# Altium project Autoinformer.PrjPcb (part 1 of 2)
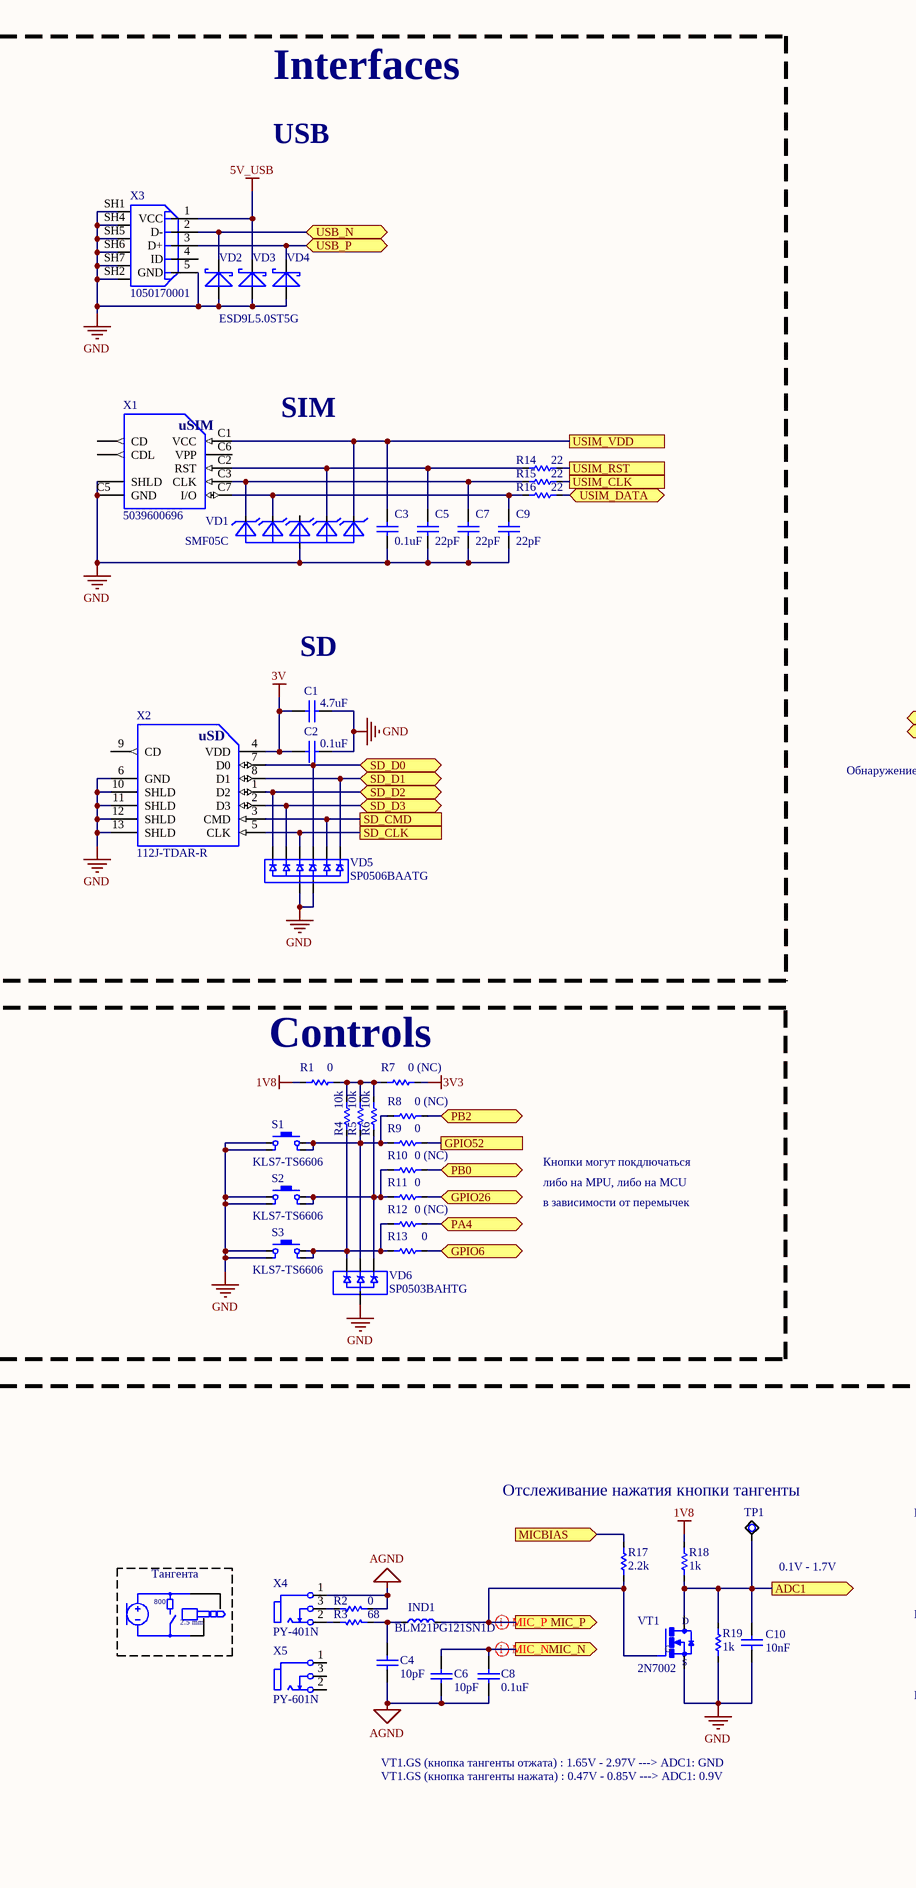
[diagram p0: Sh1_MPU.SchDoc, left]
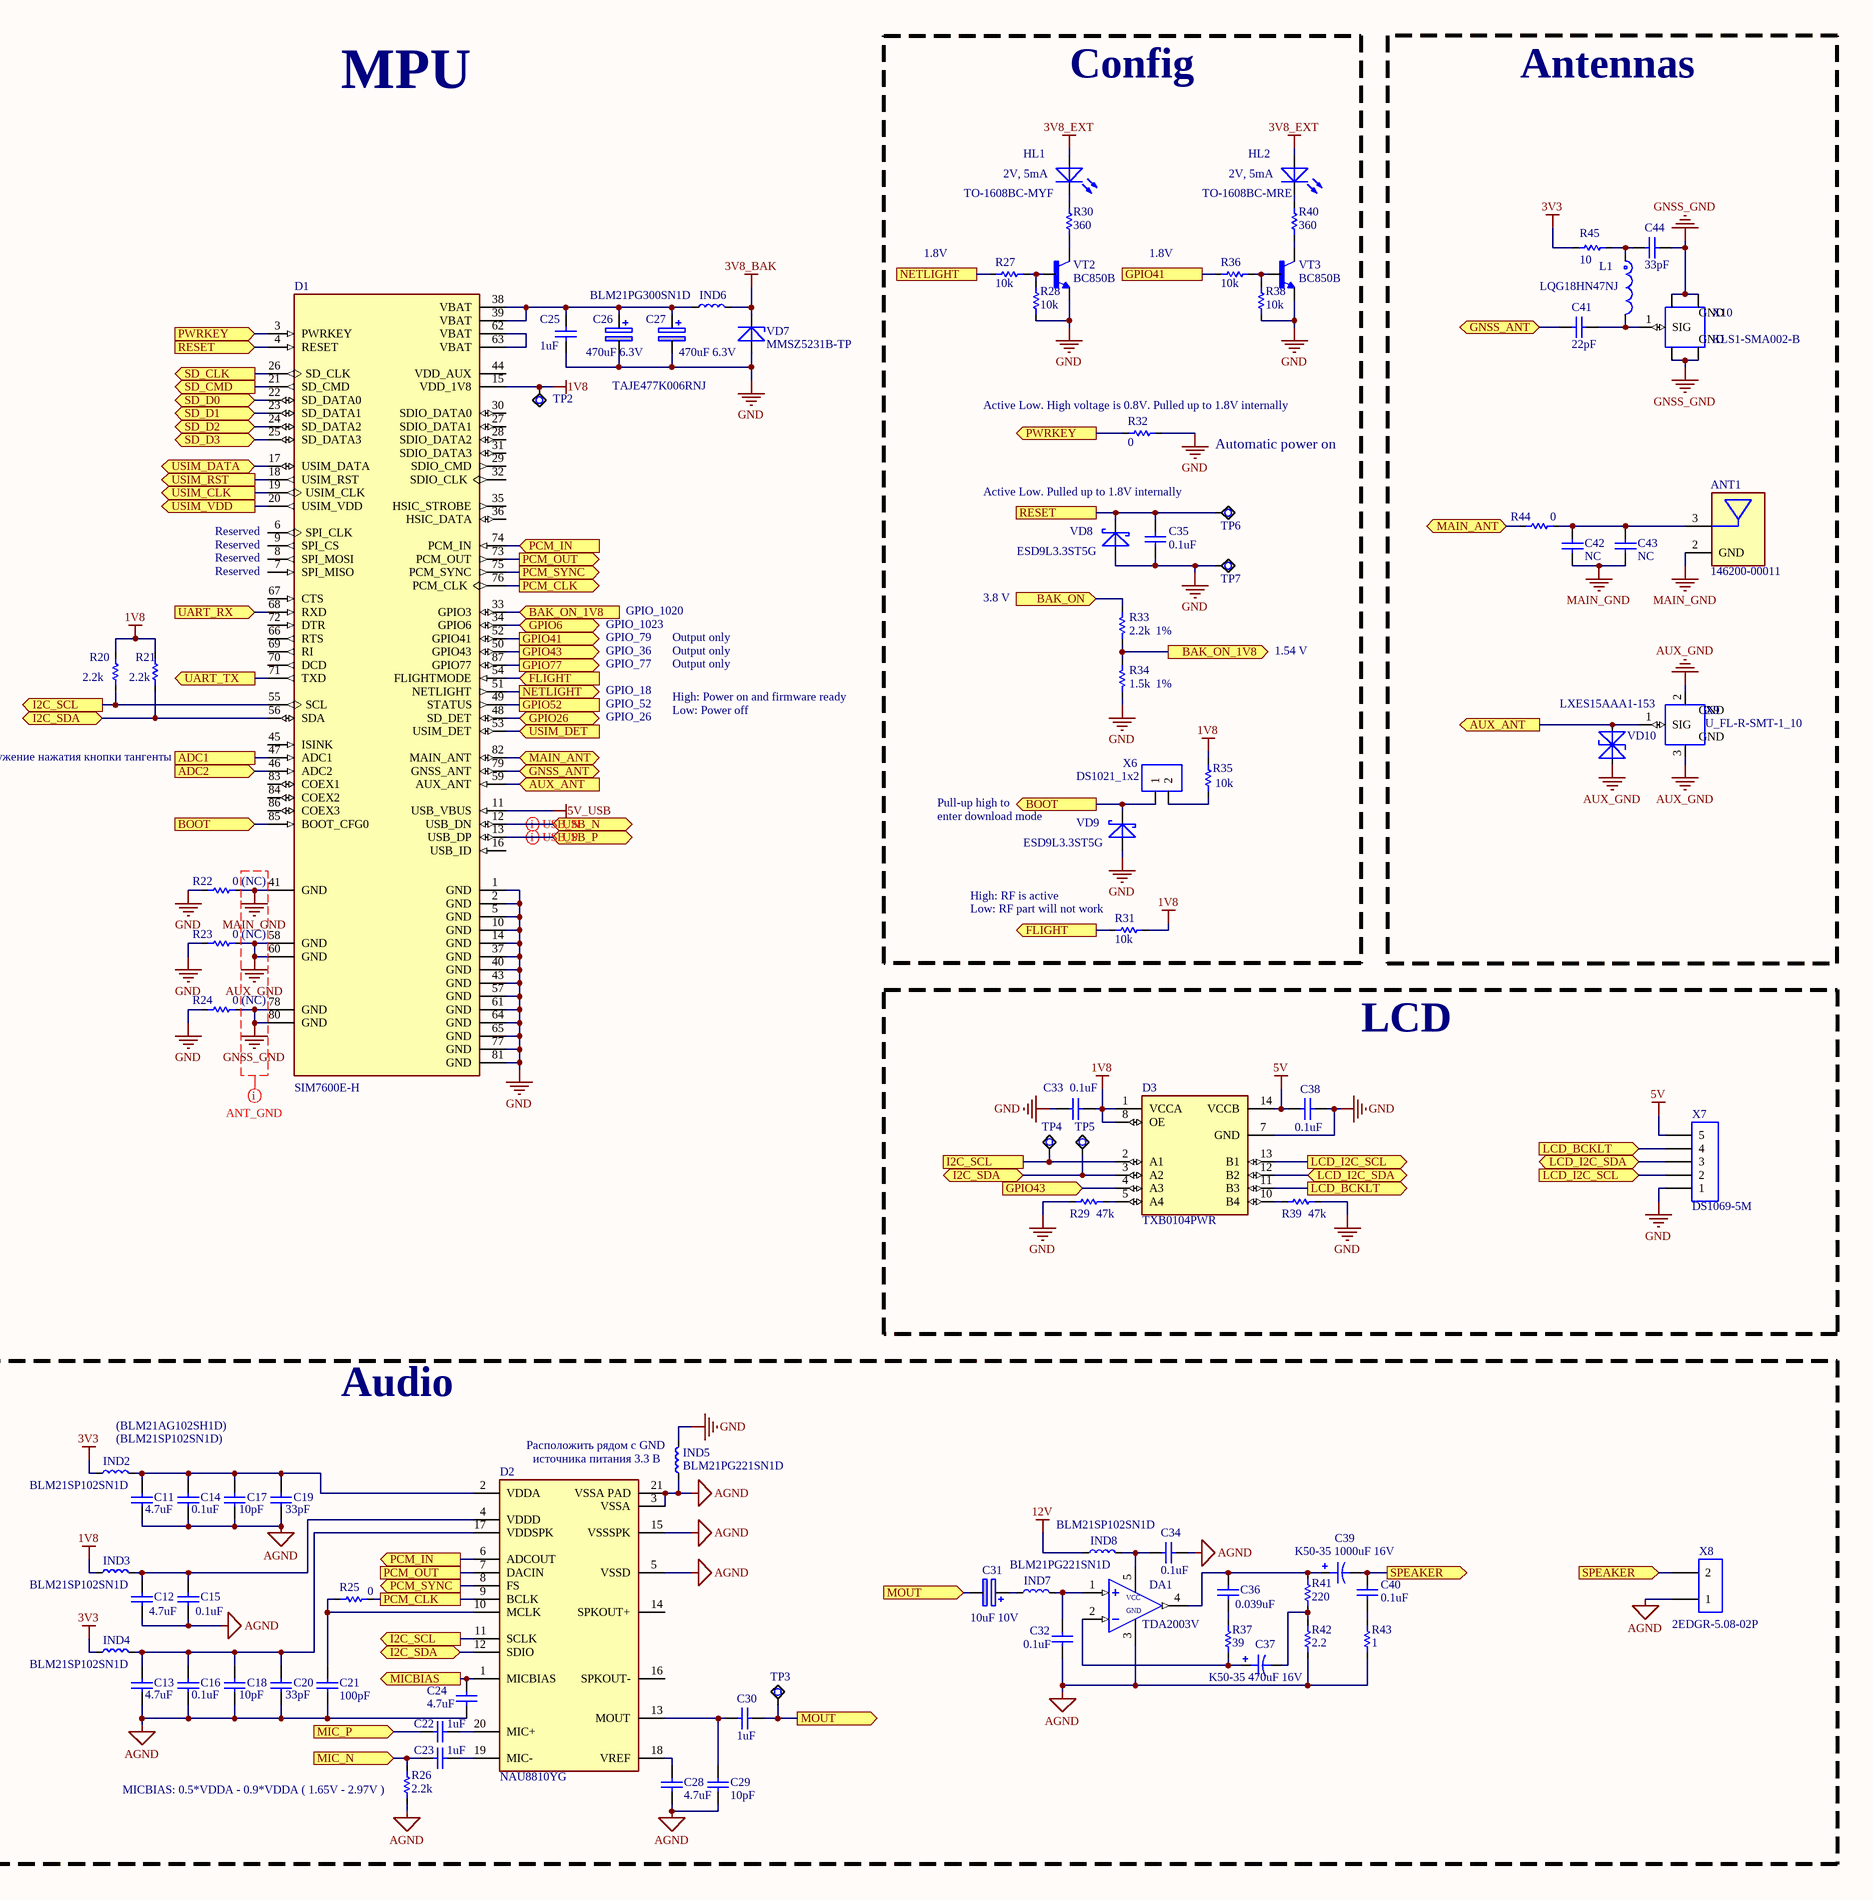
[diagram p1: Sh1_MPU.SchDoc, right]
3 sheets, 240 parts. Net scope: flat (ports and power ports of the same name join across sheets).
Board file: AutoinformerPCB.PcbDoc
Sheets:
  Sh1_MPU.SchDoc
  Sh2_MCU.SchDoc
  Sh3_Power.SchDoc

## Sheet Sh1_MPU.SchDoc
size A2

### Parts
ANT1  146200-00011  [Molex_146200-0011_MFG]
C1  4.7uF  [C_SMD0603]
C2  0.1uF  [C_SMD0603]
C3  0.1uF  [C_SMD0603]
C4  10pF  [C_SMD0603]
C5  22pF  [C_SMD0603]
C6  10pF  [C_SMD0603]
C7  22pF  [C_SMD0603]
C8  0.1uF  [C_SMD0603]
C9  22pF  [C_SMD0603]
C10  10nF  [C_SMD0603]
C11  4.7uF  [C_SMD0603]
C12  4.7uF  [C_SMD0603]
C13  4.7uF  [C_SMD0603]
C14  0.1uF  [C_SMD0603]
C15  0.1uF  [C_SMD0603]
C16  0.1uF  [C_SMD0603]
C17  10pF  [C_SMD0603]
C18  10pF  [C_SMD0603]
C19  33pF  [C_SMD0603]
C20  33pF  [C_SMD0603]
C21  100pF  [C_SMD0603]
C22  1uF  [C_SMD0603]
C23  1uF  [C_SMD0603]
C24  4.7uF  [C_SMD0603]
C25  1uF  [C_SMD0603]
C26  470uF 6.3V  [TECAP_E]
C27  470uF 6.3V  [TECAP_E]
C28  4.7uF  [C_SMD0603]
C29  10pF  [C_SMD0603]
C30  1uF  [C_SMD1206]
C31  10uF 10V  [TECAP_B]
C32  0.1uF  [C_SMD0603]
C33  0.1uF  [C_SMD0603]
C34  0.1uF  [C_SMD0603]
C35  0.1uF  [C_SMD0603]
C36  0.039uF  [C_SMD0603]
C37  K50-35 470uF 16V  [K50-35 8x11.5x3.5]
C38  0.1uF  [C_SMD0603]
C39  K50-35 1000uF 16V  [K50-35 10x12.5x5]
C40  0.1uF  [C_SMD0603]
C41  22pF  [C_SMD0805]
C42  NС  [C_SMD0603]
C43  NС  [C_SMD0603]
C44  33pF  [C_SMD0603]
D1  SIM7600E-H  [IC_SIM7600E-H]
D2  NAU8810YG  [NAU8810YG]
D3  TXB0104PWR  [SOP65P640X120-14N]
DA1  TDA2003V  [TDA2003V _HS-117-30 (ABM-161-30)]
HL1  TO-1608BC-MYF  [LED_SMD1608 + THR0254]
HL2  TO-1608BC-MRE  [LED_SMD1608 + THR0254]
IND1  BLM21PG121SN1D  [BLM21PG221_0805]
IND2  BLM21SP102SN1D  [BLM21PG221_0805]
IND3  BLM21SP102SN1D  [BLM21PG221_0805]
IND4  BLM21SP102SN1D  [BLM21PG221_0805]
IND5  BLM21PG221SN1D  [BLM21PG221_0805]
IND6  BLM21PG300SN1D  [BLM21PG221_0805]
IND7  BLM21PG221SN1D  [BLM21PG221_0805]
IND8  BLM21SP102SN1D  [BLM21PG221_0805]
L1  LQG18HN47NJ  [L0603]
R1  0  [R_SMD0603]
R2  0  [R_SMD0603]
R3  68  [R_SMD0603]
R4  10k  [R_SMD0603]
R5  10k  [R_SMD0603]
R6  10k  [R_SMD0603]
R7  0 (NC)  [R_SMD0603]
R8  0 (NC)  [R_SMD0603]
R9  0  [R_SMD0603]
R10  0 (NC)  [R_SMD0603]
R11  0  [R_SMD0603]
R12  0 (NC)  [R_SMD0603]
R13  0  [R_SMD0603]
R14  22  [R_SMD0603]
R15  22  [R_SMD0603]
R16  22  [R_SMD0603]
R17  2.2k  [R_SMD0603]
R18  1k  [R_SMD0603]
R19  1k  [R_SMD0603]
R20  2.2k  [R_SMD0603]
R21  2.2k  [R_SMD0603]
R22  0 (NC)  [R_SMD0805]
R23  0 (NC)  [R_SMD0805]
R24  0 (NC)  [R_SMD0805]
R25  0  [R_SMD0603]
R26  2.2k  [R_SMD0603]
R27  10k  [R_SMD0603]
R28  10k  [R_SMD0603]
R29  47k  [R_SMD0603]
R30  360  [R_SMD0603]
R31  10k  [R_SMD0603]
R32  0  [R_SMD0603]
R33  2.2k  [R_SMD0603]
R34  1.5k  [R_SMD0603]
R35  10k  [R_SMD0603]
R36  10k  [R_SMD0603]
R37  39  [R_SMD0603]
R38  10k  [R_SMD0603]
R39  47k  [R_SMD0603]
R40  360  [R_SMD0603]
R41  220  [R_SMD0603]
R42  2.2  [R_SMD0603]
R43  1  [R_SMD0603]
R44  0  [R_SMD0805]
R45  10  [R_SMD0603]
S1  KLS7-TS6606  [KLS7-TS6606 -7.0]
S2  KLS7-TS6606  [KLS7-TS6606 -7.0]
S3  KLS7-TS6606  [KLS7-TS6606 -7.0]
TP1  Test_point  [TEST_POINT]  (value not drawn)
TP2  Test_point  [TEST_POINT]  (value not drawn)
TP3  Test_point  [TEST_POINT]  (value not drawn)
TP4  Test_point  [TEST_POINT]  (value not drawn)
TP5  Test_point  [TEST_POINT]  (value not drawn)
TP6  Test_point  [TEST_POINT]  (value not drawn)
TP7  Test_point  [TEST_POINT]  (value not drawn)
VD1  SMF05C  [SMF05C]
VD2  ESD9L5.0ST5G  [ESD9L5_514AB]  (value not drawn)
VD3  ESD9L5.0ST5G  [ESD9L5_514AB]  (value not drawn)
VD4  ESD9L5.0ST5G  [ESD9L5_514AB]
VD5  SP0506BAATG  [SOP65P490X110-8N]
VD6  SP0503BAHTG  [SP0503BAHTG]
VD7  MMSZ5231B-TP  [SOD-123_3716X135N]
VD8  ESD9L3.3ST5G  [ESD9L5_514AB]
VD9  ESD9L3.3ST5G  [ESD9L5_514AB]
VD10  LXES15AAA1-153  [Murata_LXES15_IPC_A]
VT1  2N7002  [SOT23]
VT2  BC850B  [SOT23-3]
VT3  BC850B  [SOT23-3]
X1  5039600696  [MOLEX_uSIM_5039600696]
X2  112J-TDAR-R  [112JTDARR]
X3  1050170001  [MOLEX_1050170001 - compact]
X4  PY-401N  [PY-401N - compact]
X5  PY-601N  [PY-601N - compact]
X6  DS1021_1x2  [PLD2]
X7  DS1069-5M  [DS1069-5M]
X8  2EDGR-5.08-02P  [2EDGR-5.08-02P]
X9  U_FL-R-SMT-1_10  [HIROSE_0_MFG]
X10  KLS1-SMA002-B  [SMA-FEMALE-RA - L-KLS1-SMA002-B]

### Blocks framed on the sheet
Interfaces: C1-C3 C5 C7 C9 R14-R16 VD1-VD5 X1-X3
Config: C35 HL1 HL2 R27 R28 R30-R36 R38 R40 TP6 TP7 VD8 VD9 VT2 VT3 X6
Antennas: ANT1 C41-C44 L1 R44 R45 VD10 X9 X10
Controls: R1 R4-R13 S1-S3 VD6
LCD: C33 C38 D3 R29 R39 TP4 TP5 X7
Audio: C4 C6 C8 C10-C24 C28-C32 C34 C36 C37 C39 C40 D2 DA1 IND1-IND5 IND7 IND8 R2 R3 R17-R19 R25 R26 R37 R41-R43 TP1 TP3 VT1 X4 X5 X8

### Ports
ADC1, ADC1 (out), ADC2 (in), AUX_ANT (in), AUX_ANT (out), BAK_ON (in), BAK_ON_1V8 (in), BAK_ON_1V8 (out), BOOT (in), BOOT (out), FLIGHT (in), FLIGHT (out), GNSS_ANT (bidir), GPIO6 (bidir), GPIO26 (bidir), GPIO41, GPIO41 (out), GPIO43 (in), GPIO43 (out), GPIO52, GPIO77 (out), I2C_SCL, I2C_SCL (out), I2C_SDA (bidir), LCD_BCKLT (in), LCD_BCKLT (out), LCD_I2C_SCL (in), LCD_I2C_SCL (out), LCD_I2C_SDA (bidir), MAIN_ANT (bidir), MIC_N (in), MIC_N (out), MIC_P (in), MIC_P (out), MICBIAS (in), MICBIAS (out), MOUT (in), MOUT (out), NETLIGHT, NETLIGHT (out), PA4 (bidir), PB0 (bidir), PB2 (bidir), PCM_CLK, PCM_CLK (out), PCM_IN (in), PCM_IN (out), PCM_OUT, PCM_OUT (out), PCM_SYNC (out), PWRKEY (in), PWRKEY (out), RESET, RESET (in), SD_CLK, SD_CLK (out), SD_CMD, SD_CMD (out), SD_D0 (bidir), SD_D1 (bidir), SD_D2 (bidir), SD_D3 (bidir), SPEAKER (in), SPEAKER (out), UART_RX (in), UART_TX (out), USB_N (bidir), USB_P (bidir), USIM_CLK, USIM_CLK (out), USIM_DATA (bidir), USIM_DET (in), USIM_RST, USIM_RST (out), USIM_VDD, USIM_VDD (out)

### Nets
1V8: C33.1 D1.15(VDD_1V8) D3.1(VCCA) D3.8(OE) IND3.1 R1.2(CW) R18.1(CCW) R20.2(CW) R21.2(CW) R31.2(CW) R35.1(CCW) TP2.1
3V: C1.2 C2.2 X2.4(VDD)
3V3: IND2.1 IND4.1 R7.1(CCW) R45.2(CW)
3V8_BAK: IND6.2 VD7.C(NEG)
3V8_EXT: HL1.1(POS) HL2.1(POS)
5V: C38.2 D3.14(VCCB) X7.5
5V_USB: D1.11(USB_VBUS) VD3.2(NEG) X3.1(VCC)
12V: IND8.1
AGND: C4.2 C6.1 C8.2 C11.2 C12.2 C13.2 C14.2 C15.2 C16.2 C17.2 C18.2 C19.2 C20.2 C21.1 C24.1 C28.1 C29.1 C32.2 C34.2 D2.3(VSSA) D2.5(VSSD) D2.15(VSSSPK) D2.21(VSSA_PAD) DA1.3(GND) IND5.1 R2.1(CCW) R26.2(CW) R42.2(CW) R43.2(CW) X4.1 X8.1
AUX_GND: D1.58(GND) D1.60(GND) R23.2(CW) VD10.1(A) X9.2(GND) X9.3(GND)
GND: C1.1 C2.1 C3.2 C5.2 C7.2 C9.2 C10.2 C25.2 C26.2(-) C27.2(-) C33.2 C35.2 C38.1 D1.1(GND) D1.2(GND) D1.5(GND) D1.10(GND) D1.14(GND) D1.37(GND) D1.40(GND) D1.43(GND) D1.57(GND) D1.61(GND) D1.64(GND) D1.65(GND) D1.77(GND) D1.81(GND) D3.7(GND) IND5.2 R19.2(CW) R22.1(CCW) R23.1(CCW) R24.1(CCW) R28.1(CCW) R29.2(CW) R32.2(CW) R34.1(CCW) R38.1(CCW) R39.2(CW) S1.1 S1.2 S2.1 S2.2 S3.1 S3.2 TP7.1 VD1.2(A) VD2.1(POS) VD3.1(POS) VD4.1(POS) VD5.1(GND) VD5.8(GND) VD6.1(GND) VD7.A(POS) VD8.1(POS) VD9.1(POS) VT1.2(S) VT2.2(E) VT3.2(E) X1.C5(GND) X1.SHLD X2.6(GND) X2.10(SHLD) X2.11(SHLD) X2.12(SHLD) X2.13(SHLD) X3.5(GND) X3.SH1(SHIELD) X3.SH2(SHIELD) X3.SH4(SHIELD) X3.SH5(SHIELD) X3.SH6(SHIELD) X3.SH7(SHIELD) X7.1
GNSS_GND: C44.1 D1.78(GND) D1.80(GND) R24.2(CW) X10.G(GND)
MAIN_GND: ANT1.2(GND) C42.1 C43.1 D1.41(GND) R22.2(CW)
ADC1: C10.1 D1.47(ADC1) R18.2(CW) R19.1(CCW) TP1.1 VT1.3(D) ; port ADC1
ADC2: D1.46(ADC2) ; port ADC2
AUX_ANT: D1.59(AUX_ANT) VD10.2(K) X9.1(SIG) ; port AUX_ANT
BAK_ON: R33.2(CW) ; port BAK_ON
BAK_ON_1V8: D1.33(GPIO3) R33.1(CCW) R34.2(CW) ; port BAK_ON_1V8
BOOT: D1.85(BOOT_CFG0) VD9.2(NEG) X6.1 ; port BOOT
FLIGHT: D1.54(FLIGHTMODE) R31.1(CCW) ; port FLIGHT
GNSS_ANT: C41.2 D1.79(GNSS_ANT) ; port GNSS_ANT
GPIO6: D1.34(GPIO6) R13.1(CCW) ; port GPIO6
GPIO26: D1.48(SD_DET) R11.1(CCW) ; port GPIO26
GPIO41: D1.52(GPIO41) R36.1(CCW) ; port GPIO41
GPIO43: D1.50(GPIO43) D3.4(A3) ; port GPIO43
GPIO52: D1.49(STATUS) R9.1(CCW) ; port GPIO52
GPIO77: D1.87(GPIO77) ; port GPIO77
I2C_SCL: D1.55(SCL) D2.11(SCLK) D3.2(A1) R20.1(CCW) TP4.1 ; port I2C_SCL
I2C_SDA: D1.56(SDA) D2.12(SDIO) D3.3(A2) R21.1(CCW) TP5.1 ; port I2C_SDA
LCD_BCKLT: D3.11(B3) X7.4 ; port LCD_BCKLT
LCD_I2C_SCL: D3.13(B1) X7.2 ; port LCD_I2C_SCL
LCD_I2C_SDA: D3.12(B2) X7.3 ; port LCD_I2C_SDA
MAIN_ANT: D1.82(MAIN_ANT) R44.1(CCW) ; port MAIN_ANT
MIC_N: C6.2 C8.1 C23.1 R26.1(CCW) ; port MIC_N
MIC_P: C22.1 IND1.1 R17.2(CW) VT1.1(G) ; port MIC_P
MICBIAS: C24.2 D2.1(MICBIAS) R17.1(CCW) ; port MICBIAS
MOUT: C30.1 C31.2(-) TP3.1 ; port MOUT
NETLIGHT: D1.51(NETLIGHT) R27.1(CCW) ; port NETLIGHT
PA4: R12.1(CCW) ; port PA4
PB0: R10.1(CCW) ; port PB0
PB2: R8.1(CCW) ; port PB2
PCM_CLK: D1.76(PCM_CLK) D2.9(BCLK) R25.1(CCW) ; port PCM_CLK
PCM_IN: D1.74(PCM_IN) D2.6(ADCOUT) ; port PCM_IN
PCM_OUT: D1.73(PCM_OUT) D2.7(DACIN) ; port PCM_OUT
PCM_SYNC: D1.75(PCM_SYNC) D2.8(FS) ; port PCM_SYNC
PWRKEY: D1.3(PWRKEY) R32.1(CCW) ; port PWRKEY
RESET: C35.1 D1.4(RESET) TP6.1 VD8.2(NEG) ; port RESET
SD_CLK: D1.26(SD_CLK) VD5.4(B) X2.5(CLK) ; port SD_CLK
SD_CMD: D1.21(SD_CMD) VD5.6(B) X2.3(CMD) ; port SD_CMD
SD_D0: D1.22(SD_DATA0) VD5.5(D) X2.7(D0) ; port SD_D0
SD_D1: D1.23(SD_DATA1) VD5.7(D) X2.8(D1) ; port SD_D1
SD_D2: D1.24(SD_DATA2) VD5.2(A) X2.1(D2) ; port SD_D2
SD_D3: D1.25(SD_DATA3) VD5.3(C) X2.2(D3) ; port SD_D3
SPEAKER: C39.2 C40.1 X8.2 ; port SPEAKER
UART_RX: D1.68(RXD) ; port UART_RX
UART_TX: D1.71(TXD) ; port UART_TX
USB_N: D1.12(USB_DN) VD2.2(NEG) X3.2(D-) ; port USB_N
USB_P: D1.13(USB_DP) VD4.2(NEG) X3.3(D+) ; port USB_P
USIM_CLK: D1.19(USIM_CLK) R15.1(CCW) ; port USIM_CLK
USIM_DATA: D1.17(USIM_DATA) R16.1(CCW) ; port USIM_DATA
USIM_DET: D1.53(USIM_DET) ; port USIM_DET
USIM_RST: D1.18(USIM_RST) R14.1(CCW) ; port USIM_RST
USIM_VDD: C3.1 D1.20(USIM_VDD) VD1.6(C5) X1.C1(VCC) ; port USIM_VDD
NetANT1_3: ANT1.3(FEEDING) C42.2 C43.2 R44.2(CW)
NetC4_1: C4.1 IND1.2 R3.1(CCW)
NetC5_1: C5.1 R14.2(CW) VD1.5(C4) X1.C2(RST)
NetC7_1: C7.1 R15.2(CW) VD1.1(C1) X1.C3(CLK)
NetC9_1: C9.1 R16.2(CW) VD1.3(C2) X1.C7(I/O)
NetC11_1: C11.1 C14.1 C17.1 C19.1 D2.2(VDDA) IND2.2
NetC12_1: C12.1 C15.1 D2.4(VDDD) IND3.2
NetC13_1: C13.1 C16.1 C18.1 C20.1 D2.17(VDDSPK) IND4.2
NetC21_2: C21.2 D2.10(MCLK) R25.2(CW)
NetC22_2: C22.2 D2.20(MIC+)
NetC23_2: C23.2 D2.19(MIC-)
NetC25_1: C25.1 C26.1(+) C27.1(+) D1.38(VBAT) D1.39(VBAT) IND6.1
NetC28_2: C28.2 D2.18(VREF)
NetC29_2: C29.2 C30.2 D2.13(MOUT)
NetC31_1: C31.1(+) IND7.1
NetC32_1: C32.1 DA1.1(+IN) IND7.2
NetC34_1: C34.1 DA1.5(VCC) IND8.2
NetC36_1: C36.1 C39.1 DA1.4(OUT) R41.1(CCW)
NetC36_2: C36.2 R37.1(CCW)
NetC37_1: C37.1 DA1.2(-IN) R37.2(CW)
NetC37_2: C37.2 R41.2(CW) R42.1(CCW)
NetC40_2: C40.2 R43.1(CCW)
NetC41_1: C41.1 L1.2 X10.1(SIG)
NetC44_2: C44.2 L1.1 R45.1(CCW)
NetD1_62: D1.62(VBAT) D1.63(VBAT)
NetD3_5: D3.5(A4) R29.1(CCW)
NetD3_10: D3.10(B4) R39.1(CCW)
NetHL1_2: HL1.2(NEG) R30.2(CW)
NetHL2_2: HL2.2(NEG) R40.2(CW)
NetR1_1: R1.1(CCW) R4.2(CW) R5.2(CW) R6.2(CW) R7.2(CW)
NetR2_2: R2.2(CW) X4.3
NetR3_2: R3.2(CW) X4.2
NetR4_1: R4.1(CCW) R12.2(CW) R13.2(CW) S3.3 S3.4 VD6.2(A)
NetR5_1: R5.1(CCW) R8.2(CW) R9.2(CW) S1.3 S1.4 VD6.4(C)
NetR6_1: R6.1(CCW) R10.2(CW) R11.2(CW) S2.3 S2.4 VD6.3(B)
NetR27_2: R27.2(CW) R28.2(CW) VT2.1(B)
NetR30_1: R30.1(CCW) VT2.3(C)
NetR35_2: R35.2(CW) X6.2
NetR36_2: R36.2(CW) R38.2(CW) VT3.1(B)
NetR40_1: R40.1(CCW) VT3.3(C)

Not connected (* = marked no-connect by the designer): D1 6(SPI_CLK) 7(SPI_MISO) 8(SPI_MOSI) 9(SPI_CS) 16(USB_ID) 27(SDIO_DATA1) 28(SDIO_DATA2) 29(SDIO_CMD) 30(SDIO_DATA0) 31(SDIO_DATA3) 32(SDIO_CLK) 35(HSIC_STROBE) 36(HSIC_DATA) 44(VDD_AUX) 45(ISINK) 66(RTS) 67(CTS) 69(RI) 70(DCD) 72(DTR) 83(COEX1) 84(COEX2) 86(COEX3); D2 14(SPKOUT+) 16(SPKOUT-); VD1 4(C3); X1 C6(VPP) CD CDL; X2 9(CD); X3 4(ID); X5 1 2 3

### Layout directives
differential pair: MIC_N, MIC_P, USB_N, USB_P
net class ANT_GND_Nets: AUX_GND, GNSS_GND, MAIN_GND

### Notes on the sheet
- MPU
- USB
- 2V, 5mA
- (near R27) 1.8V
- 1.8V
- SIM
- TAJE477K006RNJ
- (near R32) Active Low. High voltage is 0.8V. Pulled up to 1.8V internally
- (near TP6) Active Low. Pulled up to 1.8V internally
- Automatic power on
- (near D1) Reserved
- GPIO_1023
- GPIO_1020
- 3.8 V
- (near C1) SD
- GPIO_18
- GPIO_79
- GPIO_36
- GPIO_77
- Output only
- High: Power on and firmware ready
- 1%
- 1.54 V
- Обнаружение нажатия кнопки тангенты
- GPIO_26
- GPIO_52
- Low: Power off
- Pull-up high to
- enter download mode
- High: RF is active
- (near R31) Low: RF part will not work
- Кнопки могут покдлючаться
- либо на MPU, либо на MCU
- в зависимости от перемычек
- Отслеживание нажатия кнопки тангенты
- (near IND2) (BLM21SP102SN1D)
- (BLM21AG102SH1D)
- (near IND5) Расположить рядом с GND
- (near IND5) источника питания 3.3 В
- Тангента
- (near TP1) 0.1V - 1.7V
- 800
- 2.5 mm
- VT1.GS (кнопка тангенты нажата) : 0.47V - 0.85V ---> ADC1: 0.9V
- VT1.GS (кнопка тангенты отжата) : 1.65V - 2.97V ---> ADC1: GND
- (near R26) MICBIAS: 0.5*VDDA - 0.9*VDDA ( 1.65V - 2.97V )
- Title
- Size:
- Date:
- File:
- A2
- Number:
- Time:
- Revision:
- Sheet
- of
- (in symbol microSD_112J-TDAR-R) uSD
- (in symbol microSIM_Holder_5039600696) uSIM

### Library data of the parts
ANT1 = 146200-0001(11): LTE Cellular Ceramic Antenna 698MHz-2.7GHz , SMT; ComponentLink1Description: elitan; ComponentLink1URL: https://www.elitan.ru/price/item17428368
C1-C25 C28 C29 C32-C36 C38 C40 C42-C44 = C_SMD: 0603 SMD Capacitor
  C1 C11-C13 C24 C28: ComponentLink1Description: chipdip; ComponentLink1URL: https://www.chipdip.ru/product/grm188r60j475ke19d
  C2 C3 C8 C14-C16 C32-C35 C38 C40: ComponentLink1Description: chipdip; ComponentLink1URL: https://www.chipdip.ru/product0/226236018
  C4 C6 C17 C18 C29: ComponentLink1Description: chipdip; ComponentLink1URL: https://www.chipdip.ru/product0/670139747
  C5 C7 C9: ComponentLink1Description: chipdip; ComponentLink1URL: https://www.chipdip.ru/product/grm1885c1h220j
  C10: ComponentLink1Description: chipdip; ComponentLink1URL: https://www.chipdip.ru/product0/9000143994
  C19 C20 C44: ComponentLink1Description: chipdip; ComponentLink1URL: https://www.chipdip.ru/product0/565764982
  C21: ComponentLink1Description: chipdip; ComponentLink1URL: https://www.chipdip.ru/product0/305749128
  C22 C23 C25: ComponentLink1Description: chipdip; ComponentLink1URL: https://www.chipdip.ru/product/grm188r71e105ka12d
  C36: ComponentLink1Description: chipdip; ComponentLink1URL: https://www.chipdip.ru/product0/8160066189?from=suggest_product; ComponentLink2Description: elitan; ComponentLink2URL: https://www.elitan.ru/price/item8778633
C26 C27 = C_SMD_Tantalum: Конденсатор танталовый SMD тип Е; ComponentLink1Description: 470uF-10V-chipdip; ComponentLink1URL: https://www.chipdip.ru/product0/145634327?from=suggest_product
C30 = C_SMD: 1206 SMD Capacitor; ComponentLink1Description: chipdip; ComponentLink1URL: https://www.chipdip.ru/product0/959523971
C31 = C_SMD_Tantalum: Конденсатор танталовый SMD 10uF 10V тип B; ComponentLink1Description: chipdip; ComponentLink1URL: https://www.chipdip.ru/product0/146061461?from=suggest_product
C37 = K50-35: Конденсатор электролитический алюминиевый 470мкФ, 16В; ComponentLink1Description: chipdip; ComponentLink1URL: https://www.chipdip.ru/product0/9000565914
C39 = K50-35: Конденсатор электролитический алюминиевый 1000мкФ, 16В; ComponentLink1Description: chipdip; ComponentLink1URL: https://www.chipdip.ru/product0/9000565923?from=suggest_product
C41 = C_SMD: 0805 SMD Capacitor; ComponentLink1Description: chipdip; ComponentLink1URL: https://www.chipdip.ru/product0/29844
D1 = SIM7600E-H: Multi-Band LTE-TDD/LTE-FDD/HSPA+ and GSM/GPRS/EDGE module; MF: Simcom; MP: SIM7600E-H; Availability: Unavailable; Package: None; Value: *; Price: None; SnapEDA_Link: https://www.snapeda.com/parts/SIM7600E-H/SIMcom%20Wireless%20solutions%20Co.%2CLtd/view-part/2758290/?ref=snap; ComponentLink1Description: mt-systems; ComponentLink1URL: http://www.mt-system.ru/SIMCom/SIM7600E-H
D2 = NAU8810YG: AUDIO CODEC MONO 20QFN; Manufacturer: Nuvoton Technology Corporation; Voltage: 3.6V; helpURL: https://upverter.com/upn/revision/eec1ccdac07fe113/; ComponentLink2Description: Datasheet; Temperature: -40°C to +85°C; Package: QFN20; Supplier 2: Mouser; Supplier 1: Digi-Key; ComponentLink1URL: https://upverter.com/upn/revision/eec1ccdac07fe113/; Supplier Part Number 1: NAU8810YG-ND; ComponentLink1Description: Upverter; ComponentLink2URL: http://www.nuvoton.com/hq/resource-download.jsp?tp_GUID=DA00-NAU8810.1; RoHS: TRUE; Ipc Land Pattern Name: QFN50P400X400X75-20; Temperature Range High: +85°C; Digikey Description: IC AUDIO CODEC MONO 20QFN; Digikey Part Number: NAU8810YG-ND; Lead Free: yes; Temperature Range Low: -40°C; ComponentLink3Description: elitan; ComponentLink3URL: https://www.elitan.ru/price/index.php?find=NAU8810YG&delay=-1&mfg=all&seenform=y
D3 = TXB0104PWR: 4-Bit Bidirectional Voltage-Level Shifter with Auto Direction Sensing and +/-15 kV ESD Protect 14-TSSOP -40 to 85; MF: Texas Instruments; Availability: Unavailable; Texas_Instruments-Purchase-URL: https://snapeda.com/shop?store=Texas+Instruments&id=1077120; Package: TSSOP-14 Texas Instruments; MP: TXB0104PWR; SnapEDA_Link: https://www.snapeda.com/parts/TXB0104PWR/Texas%20Instruments/view-part/1077120/?ref=snap; Value: *; Price: None; ComponentLink1Description: elitan; ComponentLink1URL: https://www.elitan.ru/price/item703962
DA1 = TDA2003V: Amplifier IC 1-Channel _Mono_ Class AB 5-PENTAWATT 10W; MF: STMicroelectronics; Price: None; Availability: Unavailable; Package: Pentawatt-5 STMicroelectronics; MP: TDA2003V; Value: *; SnapEDA_Link: https://www.snapeda.com/parts/TDA2003V/STMicroelectronics/view-part/39407/?ref=snap; ComponentLink1Description: elitan; ComponentLink1URL: https://www.elitan.ru/price/item123031; ComponentLink2Description: chipdip; ComponentLink2URL: https://www.chipdip.ru/product/tda2003v?from=suggest_product; ComponentLink3Description: chipdip-radiator; ComponentLink3URL: https://www.chipdip.ru/product/hs-117-30
HL1 HL2 = LED_SMD: Vf =2 V, 20mA, 0603 / TO-1608BC-BF \  TO-1608BC-MRE
  HL1: ComponentLink1Description: chipdip-yellow-smd; ComponentLink1URL: https://www.chipdip.ru/product/to-1608bc-myf?from=suggest_product; ComponentLink2Description: chipdip-orange-thr3mm; ComponentLink2URL: https://www.chipdip.ru/product/gnl-3012ed
  HL2: ComponentLink1Description: chipdip-red-smd; ComponentLink1URL: https://www.chipdip.ru/product/to-1608bc-mre?from=suggest_product; ComponentLink2Description: elitan-red-smd; ComponentLink2URL: https://www.elitan.ru/price/item16986056; ComponentLink3Description: chipdip-orange-thr3mm; ComponentLink3URL: https://www.chipdip.ru/product/gnl-3012ed
IND1 = BLM21PG221SN1D: 0805, Дроссель подавления ЭМП 120Ohm 25% 100MHz 3A; ComponentLink1Description: 120Ohm-3A-chipdip; ComponentLink1URL: https://www.chipdip.ru/product0/8228217893; ComponentLink2Description: 120Ohm-3A-elitan; ComponentLink2URL: https://www.elitan.ru/price/item1364359
IND2-IND4 IND8 = BLM21PG221SN1D: 0805, Дроссель подавления ЭМП 1KOhm 25% 100MHz 1.6A 0.12Ohm; ComponentLink1Description: chipdip; ComponentLink1URL: https://www.chipdip.ru/product/blm21sp102sn1d; ComponentLink2Description: elitan; ComponentLink2URL: https://www.elitan.ru/price/item21298136
IND5 IND7 = BLM21PG221SN1D: 0805, Дроссель подавления ЭМП 220Ohm +25% 100MHz 2A 45mOhm; ComponentLink1Description: chipdip; ComponentLink1URL: https://www.chipdip.ru/product/blm21pg221sn1d; ComponentLink2Description: elitan; ComponentLink2URL: https://www.elitan.ru/price/item305175
IND6 = BLM21PG221SN1D: 0805, Дроссель подавления ЭМП 100МГц:30Ом; 3А; ComponentLink1Description: chipdip; ComponentLink1URL: https://www.chipdip.ru/product/blm21pg300sn1d; ComponentLink2Description: elitan; ComponentLink2URL: https://www.elitan.ru/price/item310735
L1 = LQG18HN47NJ: Чип индуктивность многослойная неэкранированная 47нГн 5% 100МГц / Maximum DC Current 300 mA / Maximum DC Resistance 700 mOhms; ComponentLink1Description: elitan; ComponentLink1URL: https://www.elitan.ru/price/item307313; ComponentLink2Description: chipdip; ComponentLink2URL: https://www.chipdip.ru/product/lqg18hn47nj?from=suggest_product
R1-R21 R25-R32 R34-R43 R45 = R_SMD: 0603 SMD Resistor; ComponentLink1Description: chipdip
  R1 R2 R7-R13 R25 R32: ComponentLink1URL: https://www.chipdip.ru/product0/9000070541
  R3: ComponentLink1URL: https://www.chipdip.ru/product0/9000079612
  R4-R6 R27 R28 R31 R35 R36 R38: ComponentLink1URL: https://www.chipdip.ru/product0/9000079736
  R14-R16: ComponentLink1URL: https://www.chipdip.ru/product0/9000079564
  R17 R20 R21 R26: ComponentLink1URL: https://www.chipdip.ru/product0/9000079720
  R18 R19: ComponentLink1URL: https://www.chipdip.ru/product0/9000079676
  R29 R39: ComponentLink1URL: https://www.chipdip.ru/product0/9000079752
  R30 R40: ComponentLink1URL: https://www.chipdip.ru/product0/9000079629
  R34: ComponentLink1URL: https://www.chipdip.ru/product0/9000079716
  R37: ComponentLink1URL: https://www.chipdip.ru/product0/9000079606
  R41: ComponentLink1URL: https://www.chipdip.ru/product0/9000079624
  R42: ComponentLink1URL: https://www.chipdip.ru/product0/9000079549
  R43: ComponentLink1URL: https://www.chipdip.ru/product0/9000079509
  R45: ComponentLink1URL: https://www.chipdip.ru/product0/9000079557
R22-R24 R44 = R_SMD: 0805 SMD Resistor; ComponentLink1Description: chipdip; ComponentLink1URL: https://www.chipdip.ru/product0/153356071
R33 = R_SMD: 0603 SMD Resistor 1%; ComponentLink1Description: chipdip; ComponentLink1URL: https://www.chipdip.ru/product0/9000079720
S1-S3 = KLS7-TS6606-8-180: 6x6 Tact Switch Series; ComponentLink1Description: kls7-ts6606-7.0_chipdip; ComponentLink1URL: https://www.chipdip.ru/product/kls7-ts6606-7.0-180-tc-0206; ComponentLink2Description: elitan-7.0; ComponentLink2URL: https://www.elitan.ru/price/item22675038
TP1-TP7 = Test_point: Test point for PCB
VD1 = SMF05C: 12.5V Clamp 8A _8/20µs_ Ipp Tvs Diode Surface Mount SC-88/SC70-6/SOT-363; MF: ON Semiconductor; Availability: Unavailable; Price: None; Package: SOT-363 ON Semiconductor; Value: *; SnapEDA_Link: https://www.snapeda.com/parts/SMF05C/ON%20Semiconductor/view-part/2782704/?ref=snap; MP: SMF05C; ComponentLink1Description: elitan; ComponentLink1URL: https://www.elitan.ru/price/item10155001; ComponentLink2Description: chipdip; ComponentLink2URL: https://www.chipdip.ru/product/smf05ct1g?from=suggest_product
VD2-VD4 VD8 VD9 = ESD9L5.0ST5G: TVS диод защитный 5В_пиковое_рабочее 9.8В_ограничение SOD923; ComponentLink1Description: elitan; ComponentLink2Description: chipdip
  VD2-VD4: ComponentLink1URL: https://www.elitan.ru/price/index.php?find=ESD9L5.0ST5G&delay=-1&mfg=all&seenform=y; ComponentLink2URL: https://www.chipdip.ru/product0/8001926257
  VD8 VD9: ComponentLink1URL: https://www.elitan.ru/price/item1205491; ComponentLink2URL: https://www.chipdip.ru/product1/8002974897?from=suggest_product
VD5 = SP0506BAATG: TVS Diode-6 Clamping Voltage Vc Max:8V; MSOP8, Operating Voltage:5.5V;; ComponentLink1Description: elitan; ComponentLink1URL: https://www.elitan.ru/price/item559579; ComponentLink2Description: chipdip; ComponentLink2URL: https://www.chipdip.ru/product0/8004936449
VD6 = SP0503BAHTG: TVS Diode-3 Рабочее напряжение 5.5 В / Максимальное напряжение фиксации 8.5 в; ComponentLink1Description: chipdip; ComponentLink1URL: https://www.chipdip.ru/product/sp0503bahtg; ComponentLink2Description: elitan; ComponentLink2URL: https://www.elitan.ru/price/item393293
VD7 = MMSZ5231B-TP: Стабилитрон 5.1В, 5%, 0.5Вт, [SOD-123]; ComponentLink1Description: chipdip; ComponentLink1URL: https://www.chipdip.ru/product/mmsz5231b-tp?from=suggest_product; ComponentLink2Description: elitan; ComponentLink2URL: https://www.elitan.ru/price/item685173
VD10 = LXES15AAA1-153: TVS диоды Подавители ЭСР / диоды для подавления переходных скачков напряжения ESD Protection Device; ComponentLink1Description: chipdip; ComponentLink1URL: https://www.chipdip.ru/product0/8001818635?from=suggest_product; ComponentLink2Description: elitan; ComponentLink2URL: https://www.elitan.ru/price/item11962267
VT1 = 2N7002: N-Channel MOSFET 60В 0.115А [SOT-23] /; ComponentLink1Description: chipdip; ComponentLink1URL: https://www.chipdip.ru/product/2n7002-tp-reel-3000; ComponentLink2Description: elitan; ComponentLink2URL: https://www.elitan.ru/price/item484309
VT2 VT3 = BC850B: Transistor, Npn, 0.1A, 50V, Vbe = 0.7V, hfe = 240 [ SOT23 ]; ComponentLink1Description: chipdip; ComponentLink1URL: https://www.chipdip.ru/product/bc850b?from=suggest_product; ComponentLink2Description: elitan; ComponentLink2URL: https://www.elitan.ru/price/item5642305
X1 = microSIM_Holder_5039600696: Соединители для карт памяти 1mm microSIM Push Push SMT; ComponentLink1Description: elitan; ComponentLink1URL: https://www.elitan.ru/price/item12310026
X2 = microSD_112J-TDAR-R: Разъем: для карт памяти; SD Micro; push-push; SMT; позолота; Manufacturer_Name: ATTEND; Datasheet Link: https://sds.compel.ru/item-pdf/04106748b1d2c9285eaa335c34b51c16/ps/attend~112j-tdar-r.pdf; Height: 1mm; Manufacturer_Part_Number: 112J-TDAR-R; ComponentLink1Description: chipdir; ComponentLink1URL: https://www.chipdip.ru/product0/8002703228; ComponentLink2Description: elitan; ComponentLink2URL: https://www.elitan.ru/price/item10898530
X3 = microUSB_1050170001: USB - micro B USB 2.0 Receptacle Connector 5 Position Surface Mount, Right Angle; Through Hole; MF: Molex; Digi-Key_Purchase_URL: https://www.digikey.com/product-detail/en/molex/1050170001/WM1399CT-ND/2350885?utm_source=snapeda&utm_medium=aggregator&utm_campaign=symbol; Digi-Key_Part_Number: WM1399CT-ND; Package: None; SnapEDA_Link: https://www.snapeda.com/parts/1050170001/Molex/view-part/2755530/?ref=snap; MP: 1050170001; Value: *; ComponentLink1Description: elitan; ComponentLink1URL: https://www.elitan.ru/price/item5116026; ComponentLink2Description: chipdip; ComponentLink2URL: https://www.chipdip.ru/product/105017-0001-molex?utm_source=google&utm_medium=cpc&position_type={position_type}|k50id|pla-293946777986|cid|11945324864|aid|488785225626|gid|115765259517&utm_campaign=G_tovarnieobjavlenija&utm_content=text1_ga&utm_term=
X4 = microJACK PY-401N: Гнездо моно 2.5мм; ComponentLink1Description: elitan; ComponentLink1URL: https://www.elitan.ru/price/index.php?find=PY-401N&delay=-1&mfg=all&seenform=y; ComponentLink2Description: chipdip; ComponentLink2URL: https://www.chipdip.ru/product/py-401n
X5 = miniJACK PY-601N: Аудио гнездо (М) 3.5мм; ComponentLink1Description: chipdip; ComponentLink1URL: https://www.chipdip.ru/product/py-601n?from=suggest_product; ComponentLink2Description: elitan; ComponentLink2URL: https://www.elitan.ru/price/index.php?find=PY-601N&delay=-1&mfg=all&seenform=y
X6 = DS1021_1x2: Вилка штыревая 2.54мм 1x2 прямая PLS-2; ComponentLink1Description: chipdip; ComponentLink1URL: https://www.chipdip.ru/product/pls-2; ComponentLink2Description: elitan; ComponentLink2URL: https://www.elitan.ru/price/item10669650
X7 = DS1069-5M: Вилка Dip прямая\угловая, шаг 2.50мм Номинальный ток: 3А АС, DC Max; ComponentLink1Description: chipdip; ComponentLink1URL: https://www.chipdip.ru/product/cwf-5?from=suggest_product; ComponentLink2Description: elitan; ComponentLink2URL: https://www.elitan.ru/price/item11496029
X8 = 2EDGR-5.08-02P: Клеммник разъемный угловой 2 конт., шаг 5.08 мм / (KLS2-EDR-5.08-02P-4) / 2EDGK-5.08-02P - ответная часть; ComponentLink1Description: chipdip; ComponentLink1URL: https://www.chipdip.ru/product/kls2-edr-5.08-02p-4-2edgr-5.08-02p; ComponentLink2Description: elitan; ComponentLink2URL: https://www.elitan.ru/price/item21239767; ComponentLink3Description: ответная-часть; ComponentLink3URL: https://www.elitan.ru/price/item130957; ComponentLink4Description: на-кабель; ComponentLink4URL: https://www.chipdip.ru/product/kls2-edk-5.08-02p-4s-2esdv-02p?from=suggest_product
X9 = U_FL-R-SMT-1_10: Разъем РЧ / 50 Ом Коаксиальный, UFL Коаксиальный, Прямое Гнездо, Вертикальный Поверхностный Монтаж SMT; ComponentLink1Description: elitan; ComponentLink1URL: https://www.elitan.ru/price/item1203541; ComponentLink2Description: chipdip; ComponentLink2URL: https://www.chipdip.ru/product0/9000586248?from=suggest_product
X10 = SMA-connector: Разъем угловой SMA гнездо на плату 50 Ом; ComponentLink1Description: platan-KLS1-SMA002-B; ComponentLink1URL: https://www.platan.ru/cgi-bin/qwery.pl/id=356964102; ComponentLink2Description: elitan-KLS1-SMA002; ComponentLink2URL: https://www.elitan.ru/price/item9893558

## Sheet Sh2_MCU.SchDoc
size A3
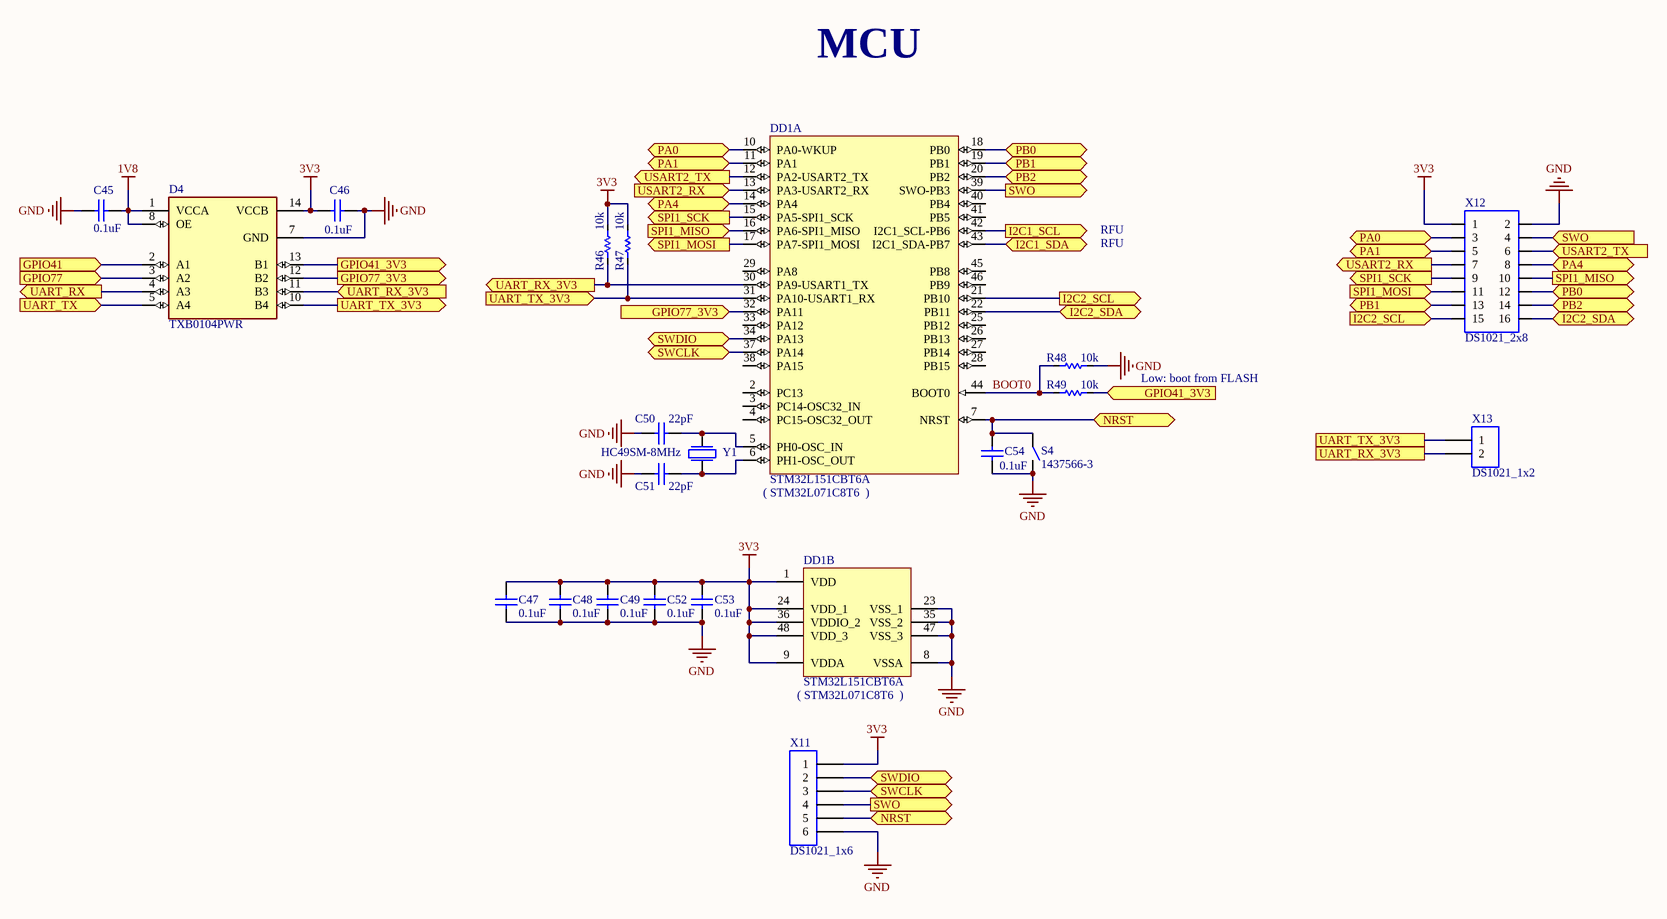
[diagram p2: Sh2_MCU.SchDoc]

### Parts
C45  0.1uF  [C_SMD0603]
C46  0.1uF  [C_SMD0603]
C47  0.1uF  [C_SMD0603]
C48  0.1uF  [C_SMD0603]
C49  0.1uF  [C_SMD0603]
C50  22pF  [C_SMD0603]
C51  22pF  [C_SMD0603]
C52  0.1uF  [C_SMD0603]
C53  0.1uF  [C_SMD0603]
C54  0.1uF  [C_SMD0603]
D4  TXB0104PWR  [SOP65P640X120-14N]
DD1  STM32L151CBT6A  [LQFP48_N]  (parts A,B of 2)
R46  10k  [R_SMD0603]
R47  10k  [R_SMD0603]
R48  10k  [R_SMD0603]
R49  10k  [R_SMD0603]
S4  1437566-3  [1437566-3]
X11  DS1021_1x6  [PLD1X6]
X12  DS1021_2x8  [PLD2X8]
X13  DS1021_1x2  [PLD2]
Y1  HC49SM-8MHz  [HC49SM]

### Ports
GPIO41 (in), GPIO41_3V3 (in), GPIO41_3V3 (out), GPIO77 (in), GPIO77_3V3 (in), GPIO77_3V3 (out), I2C1_SCL (out), I2C1_SDA (bidir), I2C2_SCL (in), I2C2_SCL (out), I2C2_SDA (bidir), NRST (bidir), PA0 (bidir), PA1 (bidir), PA4 (bidir), PB0 (bidir), PB1 (bidir), PB2 (bidir), SPI1_MISO (in), SPI1_MISO (out), SPI1_MOSI (in), SPI1_MOSI (out), SPI1_SCK (out), SWCLK (bidir), SWDIO (bidir), SWO (in), SWO (out), UART_RX (out), UART_RX_3V3, UART_RX_3V3 (in), UART_RX_3V3 (out), UART_TX (in), UART_TX_3V3, UART_TX_3V3 (in), UART_TX_3V3 (out), USART2_RX (in), USART2_RX (out), USART2_TX (in), USART2_TX (out)

### Nets
1V8: C45.1 D4.1(VCCA) D4.8(OE)
3V3: C46.2 C47.1 C48.1 C49.1 C52.1 C53.1 D4.14(VCCB) DD1.1(VDD) DD1.9(VDDA) DD1.24(VDD_1) DD1.36(VDDIO_2) DD1.48(VDD_3) R46.1(CCW) R47.1(CCW) X11.1 X12.1
GND: C45.2 C46.1 C47.2 C48.2 C49.2 C50.1 C51.1 C52.2 C53.2 C54.2 D4.7(GND) DD1.8(VSSA) DD1.23(VSS_1) DD1.35(VSS_2) DD1.47(VSS_3) R48.2(CW) S4.2 X11.6 X12.2
BOOT0: DD1.44(BOOT0) R48.1(CCW) R49.1(CCW)
GPIO41: D4.2(A1) ; port GPIO41
GPIO41_3V3: D4.13(B1) R49.2(CW) ; port GPIO41_3V3
GPIO77: D4.3(A2) ; port GPIO77
GPIO77_3V3: D4.12(B2) DD1.32(PA11) ; port GPIO77_3V3
I2C1_SCL: DD1.42(I2C1_SCL-PB6) ; port I2C1_SCL
I2C1_SDA: DD1.43(I2C1_SDA-PB7) ; port I2C1_SDA
I2C2_SCL: DD1.21(PB10) X12.15 ; port I2C2_SCL
I2C2_SDA: DD1.22(PB11) X12.16 ; port I2C2_SDA
NRST: C54.1 DD1.7(NRST) S4.1 X11.5 ; port NRST
PA0: DD1.10(PA0-WKUP) X12.3 ; port PA0
PA1: DD1.11(PA1) X12.5 ; port PA1
PA4: DD1.14(PA4) X12.8 ; port PA4
PB0: DD1.18(PB0) X12.12 ; port PB0
PB1: DD1.19(PB1) X12.13 ; port PB1
PB2: DD1.20(PB2) X12.14 ; port PB2
SPI1_MISO: DD1.16(PA6-SPI1_MISO) X12.10 ; port SPI1_MISO
SPI1_MOSI: DD1.17(PA7-SPI1_MOSI) X12.11 ; port SPI1_MOSI
SPI1_SCK: DD1.15(PA5-SPI1_SCK) X12.9 ; port SPI1_SCK
SWCLK: DD1.37(PA14) X11.3 ; port SWCLK
SWDIO: DD1.34(PA13) X11.2 ; port SWDIO
SWO: DD1.39(SWO-PB3) X11.4 X12.4 ; port SWO
UART_RX: D4.4(A3) ; port UART_RX
UART_RX_3V3: D4.11(B3) DD1.30(PA9-USART1_TX) R46.2(CW) X13.2 ; port UART_RX_3V3
UART_TX: D4.5(A4) ; port UART_TX
UART_TX_3V3: D4.10(B4) DD1.31(PA10-USART1_RX) R47.2(CW) X13.1 ; port UART_TX_3V3
USART2_RX: DD1.13(PA3-USART2_RX) X12.7 ; port USART2_RX
USART2_TX: DD1.12(PA2-USART2_TX) X12.6 ; port USART2_TX
NetC50_2: C50.2 DD1.5(PH0-OSC_IN) Y1.2
NetC51_2: C51.2 DD1.6(PH1-OSC_OUT) Y1.1

Not connected (* = marked no-connect by the designer): DD1 2(PC13) 3(PC14-OSC32_IN) 4(PC15-OSC32_OUT) 25(PB12) 26(PB13) 27(PB14) 28(PB15) 29(PA8) 33(PA12) 38(PA15) 40(PB4) 41(PB5) 45(PB8) 46(PB9)

### Notes on the sheet
- MCU
- RFU
- Low: boot from FLASH
- (near DD1) ( STM32L071C8T6  )
- Title
- Size:
- Date:
- A3
- Number:
- Time:
- Revision:
- Sheet
- of
- File:

### Library data of the parts
C45-C54 = C_SMD: 0603 SMD Capacitor; ComponentLink1Description: chipdip
  C45-C49 C52-C54: ComponentLink1URL: https://www.chipdip.ru/product0/226236018
  C50 C51: ComponentLink1URL: https://www.chipdip.ru/product/grm1885c1h220j
D4 = TXB0104PWR: as D3 on sheet Sh1_MPU; Availability: Unavailable; Texas_Instruments-Purchase-URL: https://snapeda.com/shop?store=Texas+Instruments&id=1077120; Package: TSSOP-14 Texas Instruments; MP: TXB0104PWR; SnapEDA_Link: https://www.snapeda.com/parts/TXB0104PWR/Texas%20Instruments/view-part/1077120/?ref=snap; Value: *; Price: None; ComponentLink1Description: elitan; ComponentLink1URL: https://www.elitan.ru/price/item703962
DD1 = STM32L151CBT6A: Analog - STM32L071C8T6 / Микроконтроллер 32-Бит, Cortex-M3, 32МГц, 128КБ Flash, LCD, USB, ADC, DAC [LQFP-48]; PartNumber: STM32F103C8T6; A/D Converter: 2x12-bit (10 Channel); Core: ARM Cortex-M3; FLASH Size (Prog) (kB): 64; I/Os (High Current): 37; Internal RAM Size (kB): 20; Operating Frequency(F) (Processor speed) (MHz): 72; Packing: Tray; Supply Voltage(Vcc) min (V): 2; DatasheetVersion: Rev. 16; PackageVersion: Rev. 6, 06/2013; PackageReference: LQFP48; PackageDescription: 48-Pin Low Profile Quad Flat Package, 7 x 7 mm Body, 0.5 mm Pitch; Supplier 1: Digi-Key; Supplier Part Number 1: 497-6063-ND; Supplier 2: Farnell; Supplier Part Number 2: 1447637; Supplier 3: Newark; Supplier Part Number 3: 59M2182; Supplier 4: Newark; Supplier Part Number 4: 57P1222; Supplier 5: Mouser; Supplier Part Number 5: 511-STM32F103C8T6; Mounting Technology: Surface Mount; ComponentLink1Description: elitan; ComponentLink1URL: https://www.elitan.ru/price/item11268663; ComponentLink2Description: chipdip; ComponentLink2URL: https://www.chipdip.ru/product/stm32l151cbt6a-2
R46-R49 = R_SMD: 0603 SMD Resistor; ComponentLink1Description: chipdip; ComponentLink1URL: https://www.chipdip.ru/product0/9000079736
S4 = 1437566-3: SMD button; ComponentLink1Description: chipdip; ComponentLink1URL: https://www.chipdip.ru/product/tyco-1437566-3-fsmsm?from=suggest_product; ComponentLink2Description: elitan; ComponentLink2URL: https://www.elitan.ru/price/item565583
X11 = DS1021_1x6: Вилка штыревая 2.54мм 1x6 прямая тип1 / (PLS-6); ComponentLink1Description: chipdip; ComponentLink1URL: https://www.chipdip.ru/product/pls-6; ComponentLink2Description: elitan; ComponentLink2URL: https://www.elitan.ru/price/item20933988
X12 = DS1021_2x8: Вилка штыревая 2.54мм 2х8 прямая PLD-16; ComponentLink1Description: chipdip; ComponentLink1URL: https://www.chipdip.ru/product/pld-16; ComponentLink2Description: elitan; ComponentLink2URL: https://www.elitan.ru/price/item14835380
X13 = DS1021_1x2: Вилка штыревая 2.54мм 1x2 прямая PLS-2; ComponentLink1Description: chipdip; ComponentLink1URL: https://www.chipdip.ru/product/pls-2; ComponentLink2Description: elitan; ComponentLink2URL: https://www.elitan.ru/price/item10669650
Y1 = HC49SM: 8 MHz resonator; ComponentLink1Description: 8MHz-chipdip; ComponentLink1URL: https://www.chipdip.ru/product/8mhz-hc-49sm; ComponentLink2Description: 8MHz-elitan; ComponentLink2URL: https://www.elitan.ru/price/item2093968